# Altium schematic sheet QPA9127.SchDoc
size A4; Organization: Altium Limited; Address1: L3, 12a Rodborough Rd; Address2: Frenchs Forest; Address3: NSW; Address4: Australia 2086; DocumentNumber: 4; SheetNumber: 4; SheetTotal: 7
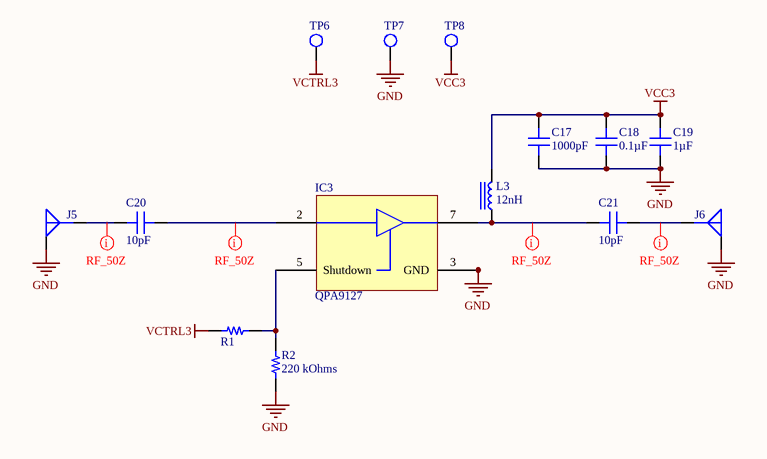
[diagram p0: QPA9127.SchDoc]

## Parts
C17  1000pF  [CAP 0402_1005]
C18  0.1µF  [CAP 0402_1005]
C19  1µF  [CAP 0402_1005]
C20  10pF  [CAP 0402_1005 RF]
C21  10pF  [CAP 0402_1005 RF]
IC3  QPA9127  [Qorvo PA DFN-8 2X2]
J5  CON-SMA-EDGE-S  [CON-SMA-EDGE-S]  (value not drawn)
J6  CON-SMA-EDGE-S  [CON-SMA-EDGE-S]  (value not drawn)
L3  12nH  [0603HP]
R1  (no value)  [RES 0402_1005]
R2  220 kOhms  [RES 0402_1005]
TP6  Test Point-THM  [KEYSTONE-THM-TestPoint]  (value not drawn)
TP7  Test Point-THM  [KEYSTONE-THM-TestPoint]  (value not drawn)
TP8  Test Point-THM  [KEYSTONE-THM-TestPoint]  (value not drawn)

## Nets
GND: C17.1 C18.1 C19.1 IC3.1(GND) IC3.3(GND) IC3.4(GND) IC3.6(GND) IC3.8(GND) IC3.9(GND) J5.2(G) J6.2(G) R2.1 TP7.1(TP)
VCC3: C17.2 C18.2 C19.2 L3.2 TP8.1(TP)
VCTRL3: R1.1 TP6.1(TP)
NetC20_1: C20.1 J5.1(S)
NetC20_2: C20.2 IC3.2(IN)
NetC21_1: C21.1 IC3.7(OUT) L3.1
NetC21_2: C21.2 J6.1(S)
NetIC3_5: IC3.5(Shutdown) R1.2 R2.2

## Layout directives
net class RF_50Z: NetC20_1, NetC20_2, NetC21_1, NetC21_2

## Notes on the sheet
- Title
- Author:
- Murat Kucukyilmaz
- Number:
- Date:
- Sheet
- of

## Library data of the parts
C17 = GCM155R71H102KA37D: CAP CER 1000PF 50V X7R 0402; Manufacturer: Murata Electronics; Tolerance: ±10%; Part Number: GCM155R71H102KA37D; Value: 1000pF; Applications: Automotive; Capacitance: 1000pF; ComponentLink1Description: Datasheet; ComponentLink1URL: https://psearch.en.murata.com/capacitor/product/GCM155R71H102KA37%23.pdf; ComponentLink2Description: DigiKey Link; ComponentLink2URL: http://digikey.com/product-detail/en/murata-electronics/GCM155R71H102KA37D/490-4761-1-ND/1641680; Device Package: 0402 (1005 Metric); LastUpdated: 2.09.2020 01:01:39; Lifecycle Status: Active; Minimum Order: 1; Mounting Type: Surface Mount, MLCC; Operating Temperature: -55°C ~ 125°C; Package / Case: 0402 (1005 Metric); Packaging: TapeAndReel; PartId: 12579; Part Status: Active; Price: 0.01; Ratings: AEC-Q200; Series: GCM; Size / Dimension: 0.039" L x 0.020" W (1.00mm x 0.50mm); Supplier 1: DigiKey; Supplier Part Number 1: 490-4761-1-ND; Temperature Coefficient: X7R; Thickness (Max): 0.022" (0.55mm); Voltage - Rated: 50V
C18 = EMK105B7104KV-F: CAP CER 0.1UF 16V X7R 0402; Manufacturer: Taiyo Yuden; Tolerance: ±10%; Part Number: EMK105B7104KV-F; Value: 0.1µF; Applications: General Purpose; Capacitance: 0.1µF; ComponentLink1Description: Datasheet; ComponentLink1URL: https://ds.yuden.co.jp/TYCOMPAS/ut/detail?pn=EMK105B7104KV-F  &u=M; ComponentLink2Description: DigiKey Link; ComponentLink2URL: http://digikey.com/product-detail/en/taiyo-yuden/EMK105B7104KV-F/587-1451-1-ND/1004082; Device Package: 0402 (1005 Metric); LastUpdated: 2.09.2020 01:02:15; Lifecycle Status: Active; Minimum Order: 1; Mounting Type: Surface Mount, MLCC; Operating Temperature: -55°C ~ 125°C; Package / Case: 0402 (1005 Metric); Packaging: CutTape; PartId: 6070; Part Status: Active; Price: 0.10; Series: M; Size / Dimension: 0.039" L x 0.020" W (1.00mm x 0.50mm); Supplier 1: DigiKey; Supplier Part Number 1: 587-1451-1-ND; Temperature Coefficient: X7R; Thickness (Max): 0.022" (0.55mm); Voltage - Rated: 16V
C19 = CL05A105KP5NNNC: CAP CER 1UF 10V X5R 0402; Manufacturer: Samsung Electro-Mechanics; Tolerance: ±10%; Part Number: CL05A105KP5NNNC; Value: 1µF; Applications: General Purpose; Capacitance: 1µF; ComponentLink1Description: Datasheet; ComponentLink1URL: http://www.samsungsem.com/kr/support/product-search/mlcc/CL05A105KP5NNNC.jsp; ComponentLink2Description: DigiKey Link; ComponentLink2URL: http://digikey.com/product-detail/en/samsung-electro-mechanics/CL05A105KP5NNNC/1276-1076-1-ND/3889162; Device Package: 0402 (1005 Metric); LastUpdated: 2.09.2020 01:02:21; Lifecycle Status: Active; Minimum Order: 1; Mounting Type: Surface Mount, MLCC; Operating Temperature: -55°C ~ 85°C; Package / Case: 0402 (1005 Metric); Packaging: TapeAndReel; PartId: 3103; Part Status: Active; Price: 0.01; Series: CL; Size / Dimension: 0.039" L x 0.020" W (1.00mm x 0.50mm); Supplier 1: DigiKey; Supplier Part Number 1: 1276-1076-1-ND; Temperature Coefficient: X5R; Thickness (Max): 0.022" (0.55mm); Voltage - Rated: 10V
C20 C21 = GJM1555C1H100FB01D: CAP CER 10PF 50V C0G/NP0 0402; Manufacturer: Murata Electronics; Temperature Coefficient: C0G, NP0; Tolerance: ±1%; Part Number: GJM1555C1H100FB01D; Applications: RF, Microwave, High Frequency; Capacitance: 10pF; ComponentLink1Description: Datasheet; ComponentLink1URL: https://search.murata.co.jp/Ceramy/image/img/A01X/G101/ENG/GJM1555C1H100FB01-01.pdf; ComponentLink2Description: DigiKey Link; ComponentLink2URL: http://digikey.com/product-detail/en/murata-electronics/GJM1555C1H100FB01D/490-11189-1-ND/5333029; Device Package: 0402 (1005 Metric); Features: High Q, Low Loss; LastUpdated: 2.09.2020 01:17:07; Lifecycle Status: Active; Minimum Order: 1; Mounting Type: Surface Mount, MLCC; Operating Temperature: -55°C ~ 125°C; Package / Case: 0402 (1005 Metric); Packaging: TapeAndReel; PartId: 560; Part Status: Active; Price: 0.04; Series: GJM; Size / Dimension: 0.039" L x 0.020" W (1.00mm x 0.50mm); Supplier 1: DigiKey; Supplier Part Number 1: 490-11189-1-ND; Thickness (Max): 0.022" (0.55mm); Value: 10pF; Voltage - Rated: 50V
IC3 = QPA9127: High Linearity Gain Block; Part Number: QPA9127; Supplier 1: Mouser; Supplier Part Number 1: 772-QPA9127TR7
J5 J6 = CON-SMA-EDGE-S: CONN SMA JACK STR EDGE MNT; Part Number: CON-SMA-EDGE-S; Supplier 1: Digi-Key; Supplier 2: Mouser; Supplier Part Number 1: CON-SMA-EDGE-S-ND; Supplier Part Number 2: 223-CON-SMA-EDGE-S
L3 = 0603HP-12NXGLW: Fixed Inductors 0603 12nH Unshld 2% 1.1A 88mOhms; Value: 12nH; Supplier 1: Mouser; Supplier Part Number 1: 994-0603HP-12NXGLW
R1 = RC0402JR-070RP: RES SMD 0 OHM JUMPER 1/16W 0402; Manufacturer: Yageo; Power (Watts): 0.063W, 1/16W; Part Number: RC0402JR-070RP; ComponentLink1Description: Datasheet; ComponentLink1URL: http://www.yageo.com/NewPortal/yageodocoutput?fileName=/pdf/R-Chip/PYu-RC_51_RoHS_P_0.pdf; ComponentLink2Description: DigiKey Link; ComponentLink2URL: http://digikey.com/product-detail/en/yageo/RC0402JR-070RP/YAG1279CT-ND/4935394; Composition: Thick Film; Device Package: 0402 (1005 Metric); Features: Moisture Resistant; Height - Seated (Max): 0.016" (0.40mm); LastUpdated: 2.09.2020 01:07:33; Lifecycle Status: Active; Minimum Order: 1; Number of Terminations: 2; Operating Temperature: -55°C ~ 155°C; Package / Case: 0402 (1005 Metric); Packaging: CutTape; PartId: 18920; Part Status: Active; Price: 0.10; Series: RC-P Lead Free; Size / Dimension: 0.039" L x 0.020" W (1.00mm x 0.50mm); Supplier 1: DigiKey; Supplier Part Number 1: YAG1279CT-ND; Supplier Device Package: 0402; Tolerance: Jumper
R2 = RC0402FR-07220KL: RES SMD 220K OHM 1% 1/16W 0402; Manufacturer: Yageo; Power (Watts): 0.063W, 1/16W; Temperature Coefficient: ±100ppm/°C; Part Number: RC0402FR-07220KL; Value: 220 kOhms; ComponentLink1Description: Datasheet; ComponentLink1URL: https://www.yageo.com/upload/media/product/productsearch/datasheet/rchip/PYu-RC_Group_51_RoHS_L_10.pdf; ComponentLink2Description: DigiKey Link; ComponentLink2URL: http://digikey.com/product-detail/en/yageo/RC0402FR-07220KL/311-220KLRCT-ND/729511; Composition: Thick Film; Device Package: 0402 (1005 Metric); Features: Moisture Resistant; Height - Seated (Max): 0.016" (0.40mm); LastUpdated: 2.09.2020 01:08:10; Lifecycle Status: Active; Minimum Order: 1; Number of Terminations: 2; Operating Temperature: -55°C ~ 155°C; Package / Case: 0402 (1005 Metric); Packaging: CutTape; PartId: 2589; Part Status: Active; Price: 0.10; Resistance: 220 kOhms; Series: RC; Size / Dimension: 0.039" L x 0.020" W (1.00mm x 0.50mm); Supplier 1: DigiKey; Supplier Part Number 1: 311-220KLRCT-ND; Supplier Device Package: 0402; Tolerance: ±1%
TP6-TP8 = Test Point-THM: THRU HOLE MOUNT TEST POINTS; Supplier 1: Digi-Key; Supplier 2: Mouser; Supplier Part Number 1: 36-5012-ND; Supplier Part Number 2: 534-5012